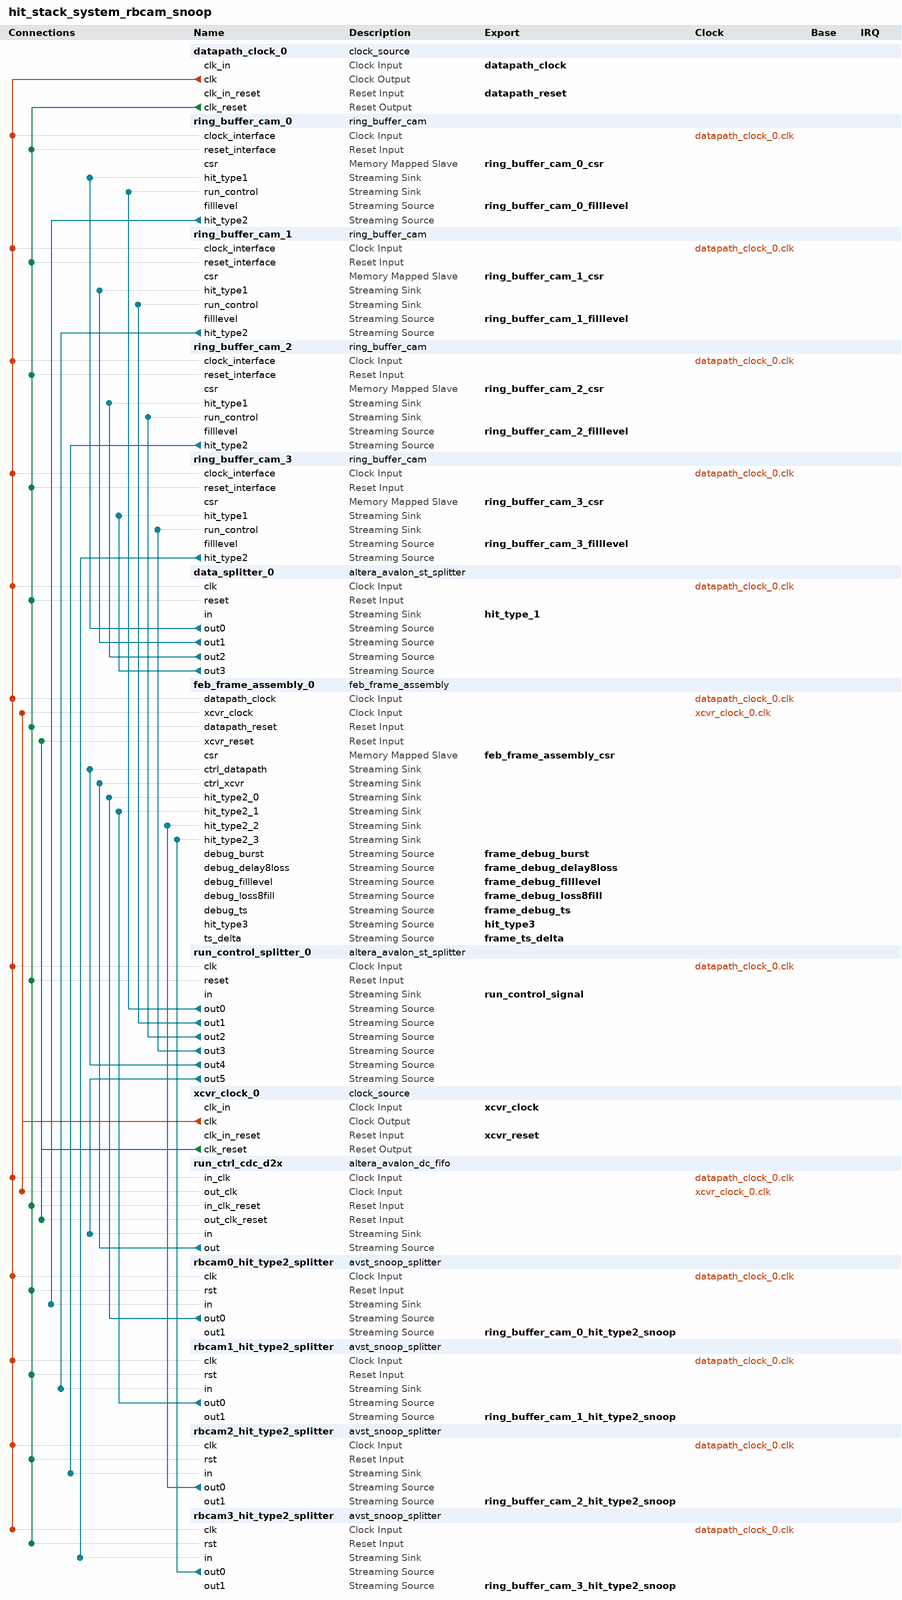
[diagram p0: system contents]
# Platform Designer (Qsys) system hit_stack_system_rbcam_snoop, Arria V 5AGXBA7D4F31C5
# Parameters at their usual value, and those the tool derives, are not listed.
package require -exact qsys 18.1
create_system hit_stack_system_rbcam_snoop
set_project_property DEVICE_FAMILY {Arria V}
set_project_property DEVICE 5AGXBA7D4F31C5

add_instance datapath_clock_0 clock_source 18.1
set_instance_parameter_value datapath_clock_0 clockFrequency 125000000
set_instance_parameter_value datapath_clock_0 resetSynchronousEdges BOTH

add_instance ring_buffer_cam_0 ring_buffer_cam 26.0.330
set_instance_parameter_value ring_buffer_cam_0 DEBUG 1
set_instance_parameter_value ring_buffer_cam_0 ENCODER_LEAF_WIDTH 16
set_instance_parameter_value ring_buffer_cam_0 ENCODER_PIPE_STAGES 4
set_instance_parameter_value ring_buffer_cam_0 INTERLEAVING_FACTOR 4
set_instance_parameter_value ring_buffer_cam_0 INTERLEAVING_INDEX 0
set_instance_parameter_value ring_buffer_cam_0 N_PARTITIONS 4
set_instance_parameter_value ring_buffer_cam_0 RING_BUFFER_N_ENTRY 512
set_instance_parameter_value ring_buffer_cam_0 SEARCH_KEY_WIDTH 8
set_instance_parameter_value ring_buffer_cam_0 SIDE_DATA_BITS 31

add_instance ring_buffer_cam_1 ring_buffer_cam 26.0.330
set_instance_parameter_value ring_buffer_cam_1 DEBUG 1
set_instance_parameter_value ring_buffer_cam_1 ENCODER_LEAF_WIDTH 16
set_instance_parameter_value ring_buffer_cam_1 ENCODER_PIPE_STAGES 4
set_instance_parameter_value ring_buffer_cam_1 INTERLEAVING_FACTOR 4
set_instance_parameter_value ring_buffer_cam_1 INTERLEAVING_INDEX 1
set_instance_parameter_value ring_buffer_cam_1 N_PARTITIONS 4
set_instance_parameter_value ring_buffer_cam_1 RING_BUFFER_N_ENTRY 512
set_instance_parameter_value ring_buffer_cam_1 SEARCH_KEY_WIDTH 8
set_instance_parameter_value ring_buffer_cam_1 SIDE_DATA_BITS 31

add_instance ring_buffer_cam_2 ring_buffer_cam 26.0.330
set_instance_parameter_value ring_buffer_cam_2 DEBUG 1
set_instance_parameter_value ring_buffer_cam_2 ENCODER_LEAF_WIDTH 16
set_instance_parameter_value ring_buffer_cam_2 ENCODER_PIPE_STAGES 4
set_instance_parameter_value ring_buffer_cam_2 INTERLEAVING_FACTOR 4
set_instance_parameter_value ring_buffer_cam_2 INTERLEAVING_INDEX 2
set_instance_parameter_value ring_buffer_cam_2 N_PARTITIONS 4
set_instance_parameter_value ring_buffer_cam_2 RING_BUFFER_N_ENTRY 512
set_instance_parameter_value ring_buffer_cam_2 SEARCH_KEY_WIDTH 8
set_instance_parameter_value ring_buffer_cam_2 SIDE_DATA_BITS 31

add_instance ring_buffer_cam_3 ring_buffer_cam 26.0.330
set_instance_parameter_value ring_buffer_cam_3 DEBUG 1
set_instance_parameter_value ring_buffer_cam_3 ENCODER_LEAF_WIDTH 16
set_instance_parameter_value ring_buffer_cam_3 ENCODER_PIPE_STAGES 4
set_instance_parameter_value ring_buffer_cam_3 INTERLEAVING_FACTOR 4
set_instance_parameter_value ring_buffer_cam_3 INTERLEAVING_INDEX 3
set_instance_parameter_value ring_buffer_cam_3 N_PARTITIONS 4
set_instance_parameter_value ring_buffer_cam_3 RING_BUFFER_N_ENTRY 512
set_instance_parameter_value ring_buffer_cam_3 SEARCH_KEY_WIDTH 8
set_instance_parameter_value ring_buffer_cam_3 SIDE_DATA_BITS 31

add_instance data_splitter_0 altera_avalon_st_splitter 18.1
set_instance_parameter_value data_splitter_0 BITS_PER_SYMBOL 39
set_instance_parameter_value data_splitter_0 CHANNEL_WIDTH 4
set_instance_parameter_value data_splitter_0 DATA_WIDTH 39
set_instance_parameter_value data_splitter_0 ERROR_DESCRIPTOR tserr
set_instance_parameter_value data_splitter_0 ERROR_WIDTH 1
set_instance_parameter_value data_splitter_0 MAX_CHANNELS 15
set_instance_parameter_value data_splitter_0 NUMBER_OF_OUTPUTS 4
set_instance_parameter_value data_splitter_0 QUALIFY_VALID_OUT 0
set_instance_parameter_value data_splitter_0 READY_LATENCY 0
set_instance_parameter_value data_splitter_0 USE_CHANNEL 1
set_instance_parameter_value data_splitter_0 USE_DATA 1
set_instance_parameter_value data_splitter_0 USE_ERROR 1
set_instance_parameter_value data_splitter_0 USE_PACKETS 1
set_instance_parameter_value data_splitter_0 USE_READY 1
set_instance_parameter_value data_splitter_0 USE_VALID 1

add_instance feb_frame_assembly_0 feb_frame_assembly 26.0.328
set_instance_parameter_value feb_frame_assembly_0 DEBUG 1
set_instance_parameter_value feb_frame_assembly_0 INTERLEAVING_FACTOR 4
set_instance_parameter_value feb_frame_assembly_0 N_SHD 128

add_instance run_control_splitter_0 altera_avalon_st_splitter 18.1
set_instance_parameter_value run_control_splitter_0 BITS_PER_SYMBOL 9
set_instance_parameter_value run_control_splitter_0 CHANNEL_WIDTH 1
set_instance_parameter_value run_control_splitter_0 DATA_WIDTH 9
set_instance_parameter_value run_control_splitter_0 ERROR_WIDTH 1
set_instance_parameter_value run_control_splitter_0 MAX_CHANNELS 1
set_instance_parameter_value run_control_splitter_0 NUMBER_OF_OUTPUTS 6
set_instance_parameter_value run_control_splitter_0 QUALIFY_VALID_OUT 0
set_instance_parameter_value run_control_splitter_0 READY_LATENCY 0
set_instance_parameter_value run_control_splitter_0 USE_CHANNEL 0
set_instance_parameter_value run_control_splitter_0 USE_DATA 1
set_instance_parameter_value run_control_splitter_0 USE_ERROR 0
set_instance_parameter_value run_control_splitter_0 USE_PACKETS 0
set_instance_parameter_value run_control_splitter_0 USE_READY 1
set_instance_parameter_value run_control_splitter_0 USE_VALID 1

add_instance xcvr_clock_0 clock_source 18.1
set_instance_parameter_value xcvr_clock_0 clockFrequency 156250000
set_instance_parameter_value xcvr_clock_0 resetSynchronousEdges BOTH

add_instance run_ctrl_cdc_d2x altera_avalon_dc_fifo 18.1
set_instance_parameter_value run_ctrl_cdc_d2x BITS_PER_SYMBOL 9
set_instance_parameter_value run_ctrl_cdc_d2x FIFO_DEPTH 16
set_instance_parameter_value run_ctrl_cdc_d2x USE_PACKETS 0

add_instance rbcam0_hit_type2_splitter avst_snoop_splitter 26.0.0.502
set_instance_parameter_value rbcam0_hit_type2_splitter CHANNEL_WIDTH 4
set_instance_parameter_value rbcam0_hit_type2_splitter DATA_WIDTH 36
set_instance_parameter_value rbcam0_hit_type2_splitter EMPTY_WIDTH 1
set_instance_parameter_value rbcam0_hit_type2_splitter ERROR_WIDTH 1

add_instance rbcam1_hit_type2_splitter avst_snoop_splitter 26.0.0.502
set_instance_parameter_value rbcam1_hit_type2_splitter CHANNEL_WIDTH 4
set_instance_parameter_value rbcam1_hit_type2_splitter DATA_WIDTH 36
set_instance_parameter_value rbcam1_hit_type2_splitter EMPTY_WIDTH 1
set_instance_parameter_value rbcam1_hit_type2_splitter ERROR_WIDTH 1

add_instance rbcam2_hit_type2_splitter avst_snoop_splitter 26.0.0.502
set_instance_parameter_value rbcam2_hit_type2_splitter CHANNEL_WIDTH 4
set_instance_parameter_value rbcam2_hit_type2_splitter DATA_WIDTH 36
set_instance_parameter_value rbcam2_hit_type2_splitter EMPTY_WIDTH 1
set_instance_parameter_value rbcam2_hit_type2_splitter ERROR_WIDTH 1

add_instance rbcam3_hit_type2_splitter avst_snoop_splitter 26.0.0.502
set_instance_parameter_value rbcam3_hit_type2_splitter CHANNEL_WIDTH 4
set_instance_parameter_value rbcam3_hit_type2_splitter DATA_WIDTH 36
set_instance_parameter_value rbcam3_hit_type2_splitter EMPTY_WIDTH 1
set_instance_parameter_value rbcam3_hit_type2_splitter ERROR_WIDTH 1

# connections
add_connection datapath_clock_0.clk data_splitter_0.clk clock
add_connection datapath_clock_0.clk feb_frame_assembly_0.datapath_clock clock
add_connection datapath_clock_0.clk rbcam0_hit_type2_splitter.clk clock
add_connection datapath_clock_0.clk rbcam1_hit_type2_splitter.clk clock
add_connection datapath_clock_0.clk rbcam2_hit_type2_splitter.clk clock
add_connection datapath_clock_0.clk rbcam3_hit_type2_splitter.clk clock
add_connection datapath_clock_0.clk ring_buffer_cam_0.clock_interface clock
add_connection datapath_clock_0.clk ring_buffer_cam_1.clock_interface clock
add_connection datapath_clock_0.clk ring_buffer_cam_2.clock_interface clock
add_connection datapath_clock_0.clk ring_buffer_cam_3.clock_interface clock
add_connection datapath_clock_0.clk run_control_splitter_0.clk clock
add_connection datapath_clock_0.clk run_ctrl_cdc_d2x.in_clk clock
add_connection xcvr_clock_0.clk feb_frame_assembly_0.xcvr_clock clock
add_connection xcvr_clock_0.clk run_ctrl_cdc_d2x.out_clk clock
add_connection datapath_clock_0.clk_reset data_splitter_0.reset reset
add_connection datapath_clock_0.clk_reset feb_frame_assembly_0.datapath_reset reset
add_connection datapath_clock_0.clk_reset rbcam0_hit_type2_splitter.rst reset
add_connection datapath_clock_0.clk_reset rbcam1_hit_type2_splitter.rst reset
add_connection datapath_clock_0.clk_reset rbcam2_hit_type2_splitter.rst reset
add_connection datapath_clock_0.clk_reset rbcam3_hit_type2_splitter.rst reset
add_connection datapath_clock_0.clk_reset ring_buffer_cam_0.reset_interface reset
add_connection datapath_clock_0.clk_reset ring_buffer_cam_1.reset_interface reset
add_connection datapath_clock_0.clk_reset ring_buffer_cam_2.reset_interface reset
add_connection datapath_clock_0.clk_reset ring_buffer_cam_3.reset_interface reset
add_connection datapath_clock_0.clk_reset run_control_splitter_0.reset reset
add_connection datapath_clock_0.clk_reset run_ctrl_cdc_d2x.in_clk_reset reset
add_connection xcvr_clock_0.clk_reset feb_frame_assembly_0.xcvr_reset reset
add_connection xcvr_clock_0.clk_reset run_ctrl_cdc_d2x.out_clk_reset reset
add_connection data_splitter_0.out0 ring_buffer_cam_0.hit_type1 avalon_streaming
add_connection data_splitter_0.out1 ring_buffer_cam_1.hit_type1 avalon_streaming
add_connection data_splitter_0.out2 ring_buffer_cam_2.hit_type1 avalon_streaming
add_connection data_splitter_0.out3 ring_buffer_cam_3.hit_type1 avalon_streaming
add_connection rbcam0_hit_type2_splitter.out0 feb_frame_assembly_0.hit_type2_0 avalon_streaming
add_connection rbcam1_hit_type2_splitter.out0 feb_frame_assembly_0.hit_type2_1 avalon_streaming
add_connection rbcam2_hit_type2_splitter.out0 feb_frame_assembly_0.hit_type2_2 avalon_streaming
add_connection rbcam3_hit_type2_splitter.out0 feb_frame_assembly_0.hit_type2_3 avalon_streaming
add_connection ring_buffer_cam_0.hit_type2 rbcam0_hit_type2_splitter.in avalon_streaming
add_connection ring_buffer_cam_1.hit_type2 rbcam1_hit_type2_splitter.in avalon_streaming
add_connection ring_buffer_cam_2.hit_type2 rbcam2_hit_type2_splitter.in avalon_streaming
add_connection ring_buffer_cam_3.hit_type2 rbcam3_hit_type2_splitter.in avalon_streaming
add_connection run_control_splitter_0.out0 ring_buffer_cam_0.run_control avalon_streaming
add_connection run_control_splitter_0.out1 ring_buffer_cam_1.run_control avalon_streaming
add_connection run_control_splitter_0.out2 ring_buffer_cam_2.run_control avalon_streaming
add_connection run_control_splitter_0.out3 ring_buffer_cam_3.run_control avalon_streaming
add_connection run_control_splitter_0.out4 feb_frame_assembly_0.ctrl_datapath avalon_streaming
add_connection run_control_splitter_0.out5 run_ctrl_cdc_d2x.in avalon_streaming
add_connection run_ctrl_cdc_d2x.out feb_frame_assembly_0.ctrl_xcvr avalon_streaming

# exported interfaces
add_interface datapath_clock clock sink
set_interface_property datapath_clock EXPORT_OF datapath_clock_0.clk_in
add_interface datapath_reset reset sink
set_interface_property datapath_reset EXPORT_OF datapath_clock_0.clk_in_reset
add_interface feb_frame_assembly_csr avalon slave
set_interface_property feb_frame_assembly_csr EXPORT_OF feb_frame_assembly_0.csr
add_interface frame_debug_burst avalon_streaming source
set_interface_property frame_debug_burst EXPORT_OF feb_frame_assembly_0.debug_burst
add_interface frame_debug_delay8loss avalon_streaming source
set_interface_property frame_debug_delay8loss EXPORT_OF feb_frame_assembly_0.debug_delay8loss
add_interface frame_debug_filllevel avalon_streaming source
set_interface_property frame_debug_filllevel EXPORT_OF feb_frame_assembly_0.debug_filllevel
add_interface frame_debug_loss8fill avalon_streaming source
set_interface_property frame_debug_loss8fill EXPORT_OF feb_frame_assembly_0.debug_loss8fill
add_interface frame_debug_ts avalon_streaming source
set_interface_property frame_debug_ts EXPORT_OF feb_frame_assembly_0.debug_ts
add_interface frame_ts_delta avalon_streaming source
set_interface_property frame_ts_delta EXPORT_OF feb_frame_assembly_0.ts_delta
add_interface hit_type3 avalon_streaming source
set_interface_property hit_type3 EXPORT_OF feb_frame_assembly_0.hit_type3
add_interface hit_type_1 avalon_streaming sink
set_interface_property hit_type_1 EXPORT_OF data_splitter_0.in
add_interface ring_buffer_cam_0_csr avalon slave
set_interface_property ring_buffer_cam_0_csr EXPORT_OF ring_buffer_cam_0.csr
add_interface ring_buffer_cam_0_filllevel avalon_streaming source
set_interface_property ring_buffer_cam_0_filllevel EXPORT_OF ring_buffer_cam_0.filllevel
add_interface ring_buffer_cam_0_hit_type2_snoop avalon_streaming source
set_interface_property ring_buffer_cam_0_hit_type2_snoop EXPORT_OF rbcam0_hit_type2_splitter.out1
add_interface ring_buffer_cam_1_csr avalon slave
set_interface_property ring_buffer_cam_1_csr EXPORT_OF ring_buffer_cam_1.csr
add_interface ring_buffer_cam_1_filllevel avalon_streaming source
set_interface_property ring_buffer_cam_1_filllevel EXPORT_OF ring_buffer_cam_1.filllevel
add_interface ring_buffer_cam_1_hit_type2_snoop avalon_streaming source
set_interface_property ring_buffer_cam_1_hit_type2_snoop EXPORT_OF rbcam1_hit_type2_splitter.out1
add_interface ring_buffer_cam_2_csr avalon slave
set_interface_property ring_buffer_cam_2_csr EXPORT_OF ring_buffer_cam_2.csr
add_interface ring_buffer_cam_2_filllevel avalon_streaming source
set_interface_property ring_buffer_cam_2_filllevel EXPORT_OF ring_buffer_cam_2.filllevel
add_interface ring_buffer_cam_2_hit_type2_snoop avalon_streaming source
set_interface_property ring_buffer_cam_2_hit_type2_snoop EXPORT_OF rbcam2_hit_type2_splitter.out1
add_interface ring_buffer_cam_3_csr avalon slave
set_interface_property ring_buffer_cam_3_csr EXPORT_OF ring_buffer_cam_3.csr
add_interface ring_buffer_cam_3_filllevel avalon_streaming source
set_interface_property ring_buffer_cam_3_filllevel EXPORT_OF ring_buffer_cam_3.filllevel
add_interface ring_buffer_cam_3_hit_type2_snoop avalon_streaming source
set_interface_property ring_buffer_cam_3_hit_type2_snoop EXPORT_OF rbcam3_hit_type2_splitter.out1
add_interface run_control_signal avalon_streaming sink
set_interface_property run_control_signal EXPORT_OF run_control_splitter_0.in
add_interface xcvr_clock clock sink
set_interface_property xcvr_clock EXPORT_OF xcvr_clock_0.clk_in
add_interface xcvr_reset reset sink
set_interface_property xcvr_reset EXPORT_OF xcvr_clock_0.clk_in_reset

set_interconnect_requirement {$system} qsys_mm.clockCrossingAdapter HANDSHAKE
set_interconnect_requirement {$system} qsys_mm.enableEccProtection FALSE
set_interconnect_requirement {$system} qsys_mm.insertDefaultSlave FALSE
set_interconnect_requirement {$system} qsys_mm.maxAdditionalLatency 1

save_system hit_stack_system_rbcam_snoop.qsys
